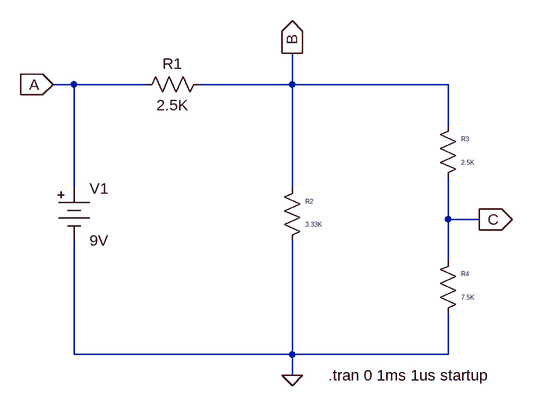
[diagram p0: schematic Innermost_circuit.asc]
Innermost_circuit.asc, the LTspice schematic file:
Version 4
SHEET 1 880 680
WIRE 144 112 112 112
WIRE 256 112 144 112
WIRE 480 112 480 64
WIRE 480 112 336 112
WIRE 720 112 480 112
WIRE 720 176 720 112
WIRE 144 272 144 112
WIRE 480 272 480 112
WIRE 720 320 720 256
WIRE 768 320 720 320
WIRE 720 384 720 320
WIRE 144 528 144 352
WIRE 480 528 480 352
WIRE 480 528 144 528
WIRE 720 528 720 464
WIRE 720 528 480 528
WIRE 480 560 480 528
FLAG 480 560 0
FLAG 768 320 C
IOPIN 768 320 Out
FLAG 112 112 A
IOPIN 112 112 In
FLAG 480 64 B
IOPIN 480 64 Out
SYMBOL Misc/battery 144 256 R0
SYMATTR InstName V1
SYMATTR Value 9V
SYMBOL res 352 96 R90
WINDOW 0 0 56 VBottom 2
WINDOW 3 32 56 VTop 2
SYMATTR InstName R1
SYMATTR Value 2.5K
SYMBOL res 464 368 M180
WINDOW 0 36 76 Left 0
WINDOW 3 36 40 Left 0
SYMATTR InstName R2
SYMATTR Value 3.33K
SYMBOL res 704 272 M180
WINDOW 0 36 76 Left 0
WINDOW 3 36 40 Left 0
SYMATTR InstName R3
SYMATTR Value 2.5K
SYMBOL res 704 480 M180
WINDOW 0 36 76 Left 0
WINDOW 3 36 40 Left 0
SYMATTR InstName R4
SYMATTR Value 7.5K
TEXT 536 560 Left 2 !.tran 0 1ms 1us startup

The netlist it stands for:
* Innermost_circuit.asc
V1 A 0 9V
R1 B A 2.5K
R2 0 B 3.33K
R3 C B 2.5K
R4 0 C 7.5K
.tran 0 1ms 1us startup
.backanno
.end